# Altium project WTC_SPI_v2.PrjPcb
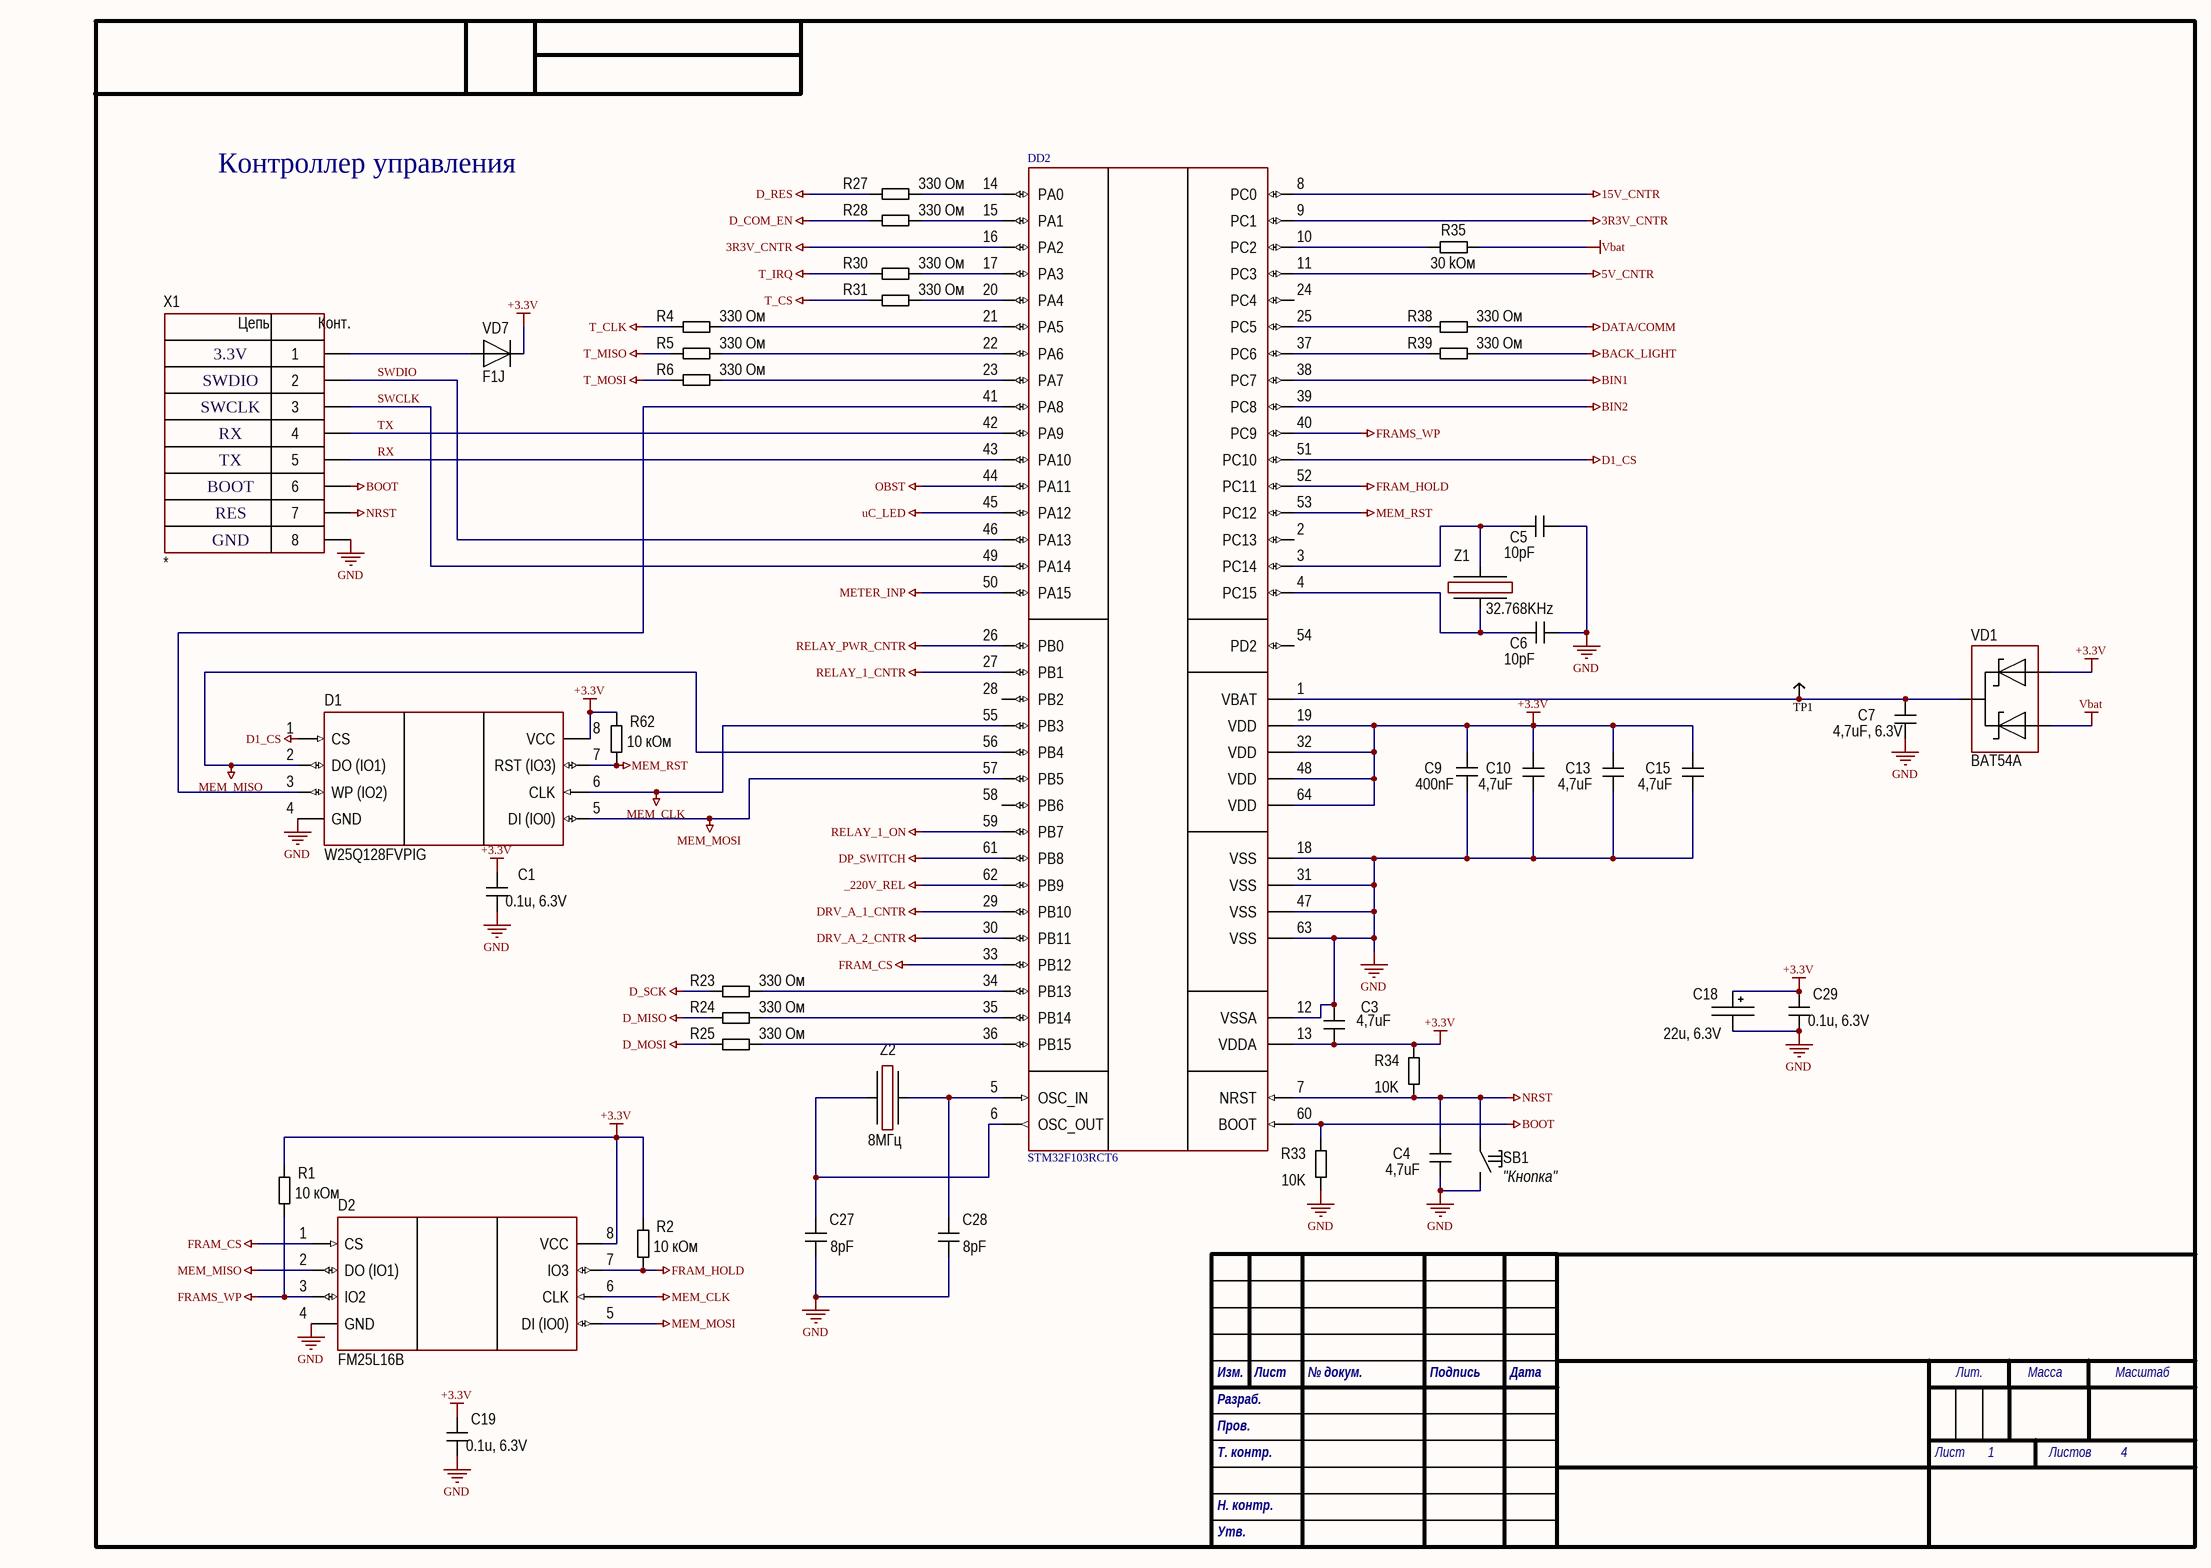
[diagram p0: 1_uC.SchDoc]
4 sheets, 159 parts. Net scope: global (net labels, ports and power ports of the same name join across sheets).
Board file: wtc_spi.PcbDoc
Sheets:
  1_uC.SchDoc
  2_PowerPerif.SchDoc
  3_InfoPerif.SchDoc
  4_PowerSupplie.SchDoc

## Sheet 1_uC.SchDoc
size 414 x 293 mm; SheetNumber: 1; SheetTotal: 4

### Parts
C1  0.1u, 6.3V  [CH0402C]
C3  4,7uF  [CH0402C]
C4  4,7uF  [CH0402C]
C5  10pF  [CH0402C]
C6  10pF  [CH0402C]
C7  4,7uF, 6.3V  [CH0402C]
C9  400nF  [CH0402C]
C10  4,7uF  [CH0402C]
C13  4,7uF  [CH0402C]
C15  4,7uF  [CH0402C]
C18  22u, 6.3V  [TANTAL_A]
C19  0.1u, 6.3V  [CH0402C]
C27  8pF  [CH0402C]
C28  8pF  [CH0402C]
C29  0.1u, 6.3V  [CH0402C]
D1  W25Q128FVPIG  [8-WSON (5x6mm)without_holes]
D2  FM25L16B  [8-SOIC]
DD2  STM32F103RCT6  [64-LQFP]
R1  10 кОм  [CH0402R]
R2  10 кОм  [CH0402R]
R4  330 Ом  [CH0402R]
R5  330 Ом  [CH0402R]
R6  330 Ом  [CH0402R]
R23  330 Ом  [CH0402R]
R24  330 Ом  [CH0402R]
R25  330 Ом  [CH0402R]
R27  330 Ом  [CH0402R]
R28  330 Ом  [CH0402R]
R30  330 Ом  [CH0402R]
R31  330 Ом  [CH0402R]
R33  10K  [CH0402R]
R34  10K  [CH0402R]
R35  30 kОм  [CH0402R]
R38  330 Ом  [CH0402R]
R39  330 Ом  [CH0402R]
R62  10 кОм  [CH0402R]
SB1  "Кнопка"  [TL1014BF160QG]
TP1  (no value)  [TestPoint]
VD1  BAT54A  [SOT23_123]
VD7  F1J  [SOD123F]
X1  *  [CON: PBS-8]
Z1  32.768KHz  [OSC: 3215]
Z2  8МГц  [OSC: ABM3]

### Nets
3R3V_CNTR: DD2.9(PC1) DD2.16(PA2)
5V_CNTR: DD2.11(PC3)
15V_CNTR: DD2.8(PC0)
+3.3V: C1.2 C3.1 C9.1 C10.2 C13.2 C15.2 C18.1 C19.2 C29.2 D1.8(VCC) D2.8(VCC) DD2.13(VDDA) DD2.19(VDD) DD2.32(VDD) DD2.48(VDD) DD2.64(VDD) R1.2 R2.2 R34.2 R62.2 VD1.1 VD7.2
_220V_REL: DD2.62(PB9)
BACK_LIGHT: R39.1
BIN1: DD2.38(PC7)
BIN2: DD2.39(PC8)
BOOT: DD2.60(BOOT) R33.2 X1.6
D1_CS: D1.1(CS) DD2.51(PC10)
D_COM_EN: R28.1
D_MISO: R24.1
D_MOSI: R25.1
D_RES: R27.1
D_SCK: R23.1
DATA/COMM: R38.1
DP_SWITCH: DD2.61(PB8)
DRV_A_1_CNTR: DD2.29(PB10)
DRV_A_2_CNTR: DD2.30(PB11)
FRAM_CS: D2.1(CS) DD2.33(PB12)
FRAM_HOLD: D2.7(IO3) DD2.52(PC11) R2.1
FRAMS_WP: D2.3(IO2) DD2.40(PC9) R1.1
GND: C1.1 C3.2 C4.1 C5.2 C6.1 C7.1 C9.2 C10.1 C13.1 C15.1 C18.2 C19.1 C27.1 C28.1 C29.1 D1.4(GND) D2.4(GND) DD2.12(VSSA) DD2.18(VSS) DD2.31(VSS) DD2.47(VSS) DD2.63(VSS) R33.1 SB1.2 X1.8
MEM_CLK: D1.6(CLK) D2.6(CLK) DD2.55(PB3)
MEM_MISO: D1.2(DO_(IO1)) D2.2(DO_(IO1)) DD2.56(PB4)
MEM_MOSI: D1.5(DI_(IO0)) D2.5(DI_(IO0)) DD2.57(PB5)
MEM_RST: D1.7(RST_(IO3)) DD2.53(PC12) R62.1
METER_INP: DD2.50(PA15)
NRST: C4.2 DD2.7(NRST) R34.1 SB1.1 X1.7
OBST: DD2.44(PA11)
RELAY_1_CNTR: DD2.27(PB1)
RELAY_1_ON: DD2.59(PB7)
RELAY_PWR_CNTR: DD2.26(PB0)
RX: DD2.43(PA10) X1.5
T_CLK: R4.1
T_CS: R31.1
T_IRQ: R30.1
T_MISO: R5.1
T_MOSI: R6.1
TX: DD2.42(PA9) X1.4
uC_LED: DD2.45(PA12)
Vbat: R35.1 VD1.3
SWCLK: DD2.49(PA14) X1.3
SWDIO: DD2.46(PA13) X1.2
NetC5_1: C5.1 DD2.3(PC14) Z1.3
NetC6_2: C6.2 DD2.4(PC15) Z1.1
NetC7_2: C7.2 DD2.1(VBAT) TP1.0 VD1.2
NetC27_2: C27.2 DD2.6(OSC_OUT) Z2.1
NetC28_2: C28.2 DD2.5(OSC_IN) Z2.3
NetD1_3: D1.3(WP_(IO2)) DD2.41(PA8)
NetDD2_10: DD2.10(PC2) R35.2
NetDD2_14: DD2.14(PA0) R27.2
NetDD2_15: DD2.15(PA1) R28.2
NetDD2_17: DD2.17(PA3) R30.2
NetDD2_20: DD2.20(PA4) R31.2
NetDD2_21: DD2.21(PA5) R4.2
NetDD2_22: DD2.22(PA6) R5.2
NetDD2_23: DD2.23(PA7) R6.2
NetDD2_25: DD2.25(PC5) R38.2
NetDD2_34: DD2.34(PB13) R23.2
NetDD2_35: DD2.35(PB14) R24.2
NetDD2_36: DD2.36(PB15) R25.2
NetDD2_37: DD2.37(PC6) R39.2
NetVD7_1: VD7.1 X1.1

Not connected (* = marked no-connect by the designer): DD2 2(PC13) 24(PC4) 28(PB2) 54(PD2) 58(PB6)

### Notes on the sheet
- Контроллер управления
- 3.3V
- SWDIO
- SWCLK
- RX
- TX
- BOOT
- RES
- GND
- Изм.
- Лист
- № докум.
- Подпись
- Дата
- Лит.
- Масса
- Масштаб
- Пров.
- Разраб.
- Т. контр.
- Н. контр.
- Листов
- Утв.
- (in symbol 8-Connector) Цепь; Конт.

### Library data of the parts
C1 C7 C19 C29 = Capacitor: Manufacturer: *; Model: *; HelpURL: *; ComponentKind: *; Value: *
C3-C6 C9 C10 C13 C15 C27 C28 = Capacitor: 0402; Manufacturer: *; Model: *; HelpURL: *; ComponentKind: *; Value: *
C18 = TantalCap: Manufacturer: *; Model: *; HelpURL: *; ComponentKind: *; Value: *
D1 = W25Q128FVPIG: Flash; Manufacturer: Winbond Electronics; Model: W25Q128FVPIG; HelpURL: https://www.digikey.com/product-detail/en/winbond-electronics/W25Q128FVPIG/W25Q128FVPIG-ND/4037386; ComponentKind: 8-WSON
D2 = W25Q80JVSSIQ: Flash; Manufacturer: Winbond Electronics; Model: W25Q80JVSSIQ; HelpURL: https://www.digikey.com/product-detail/en/winbond-electronics/W25Q80JVSSIQ/W25Q80JVSSIQ-ND/6193772; ComponentKind: 8-SOIC
DD2 = STM32F103RCT6: Cortex-M3 (64-LQFP)
R1 R2 R4-R6 R23-R25 R27 R28 R30 R31 R35 R38 R39 R62 = Resistor: 0603; Manufacturer: *; Model: *; HelpURL: *; ComponentKind: *; Value: *
R33 R34 = Resistor: 0805; Manufacturer: *; Model: *; HelpURL: *; ComponentKind: *; Value: *
SB1 = Tactile switches: 6x6 mm; Manufacturer: *; Model: *; HelpURL: *; ComponentKind: *
TP1 = TestPoint
VD1 = Diod Schottky Array v.1: SOT-23; ComponentKind: *; Manufacturer: *; Model: *; HelpURL: *
VD7 = Diod: ComponentKind: *; Manufacturer: *; Model: *; HelpURL: *
X1 = 8-Connector: Pin header 8; Model: *; Manufacturer: *; HelpURL: *; ComponentKind: *
Z1 = Oscillator: Manufacturer: *; Model: *; HelpURL: *; ComponentKind: *; Value: *
Z2 = Oscillator: NX5032GA-8MHz; Manufacturer: *; Model: *; HelpURL: *; ComponentKind: *; Value: *

## Sheet 2_PowerPerif.SchDoc
size 414 x 293 mm; SheetNumber: 2; SheetTotal: 4
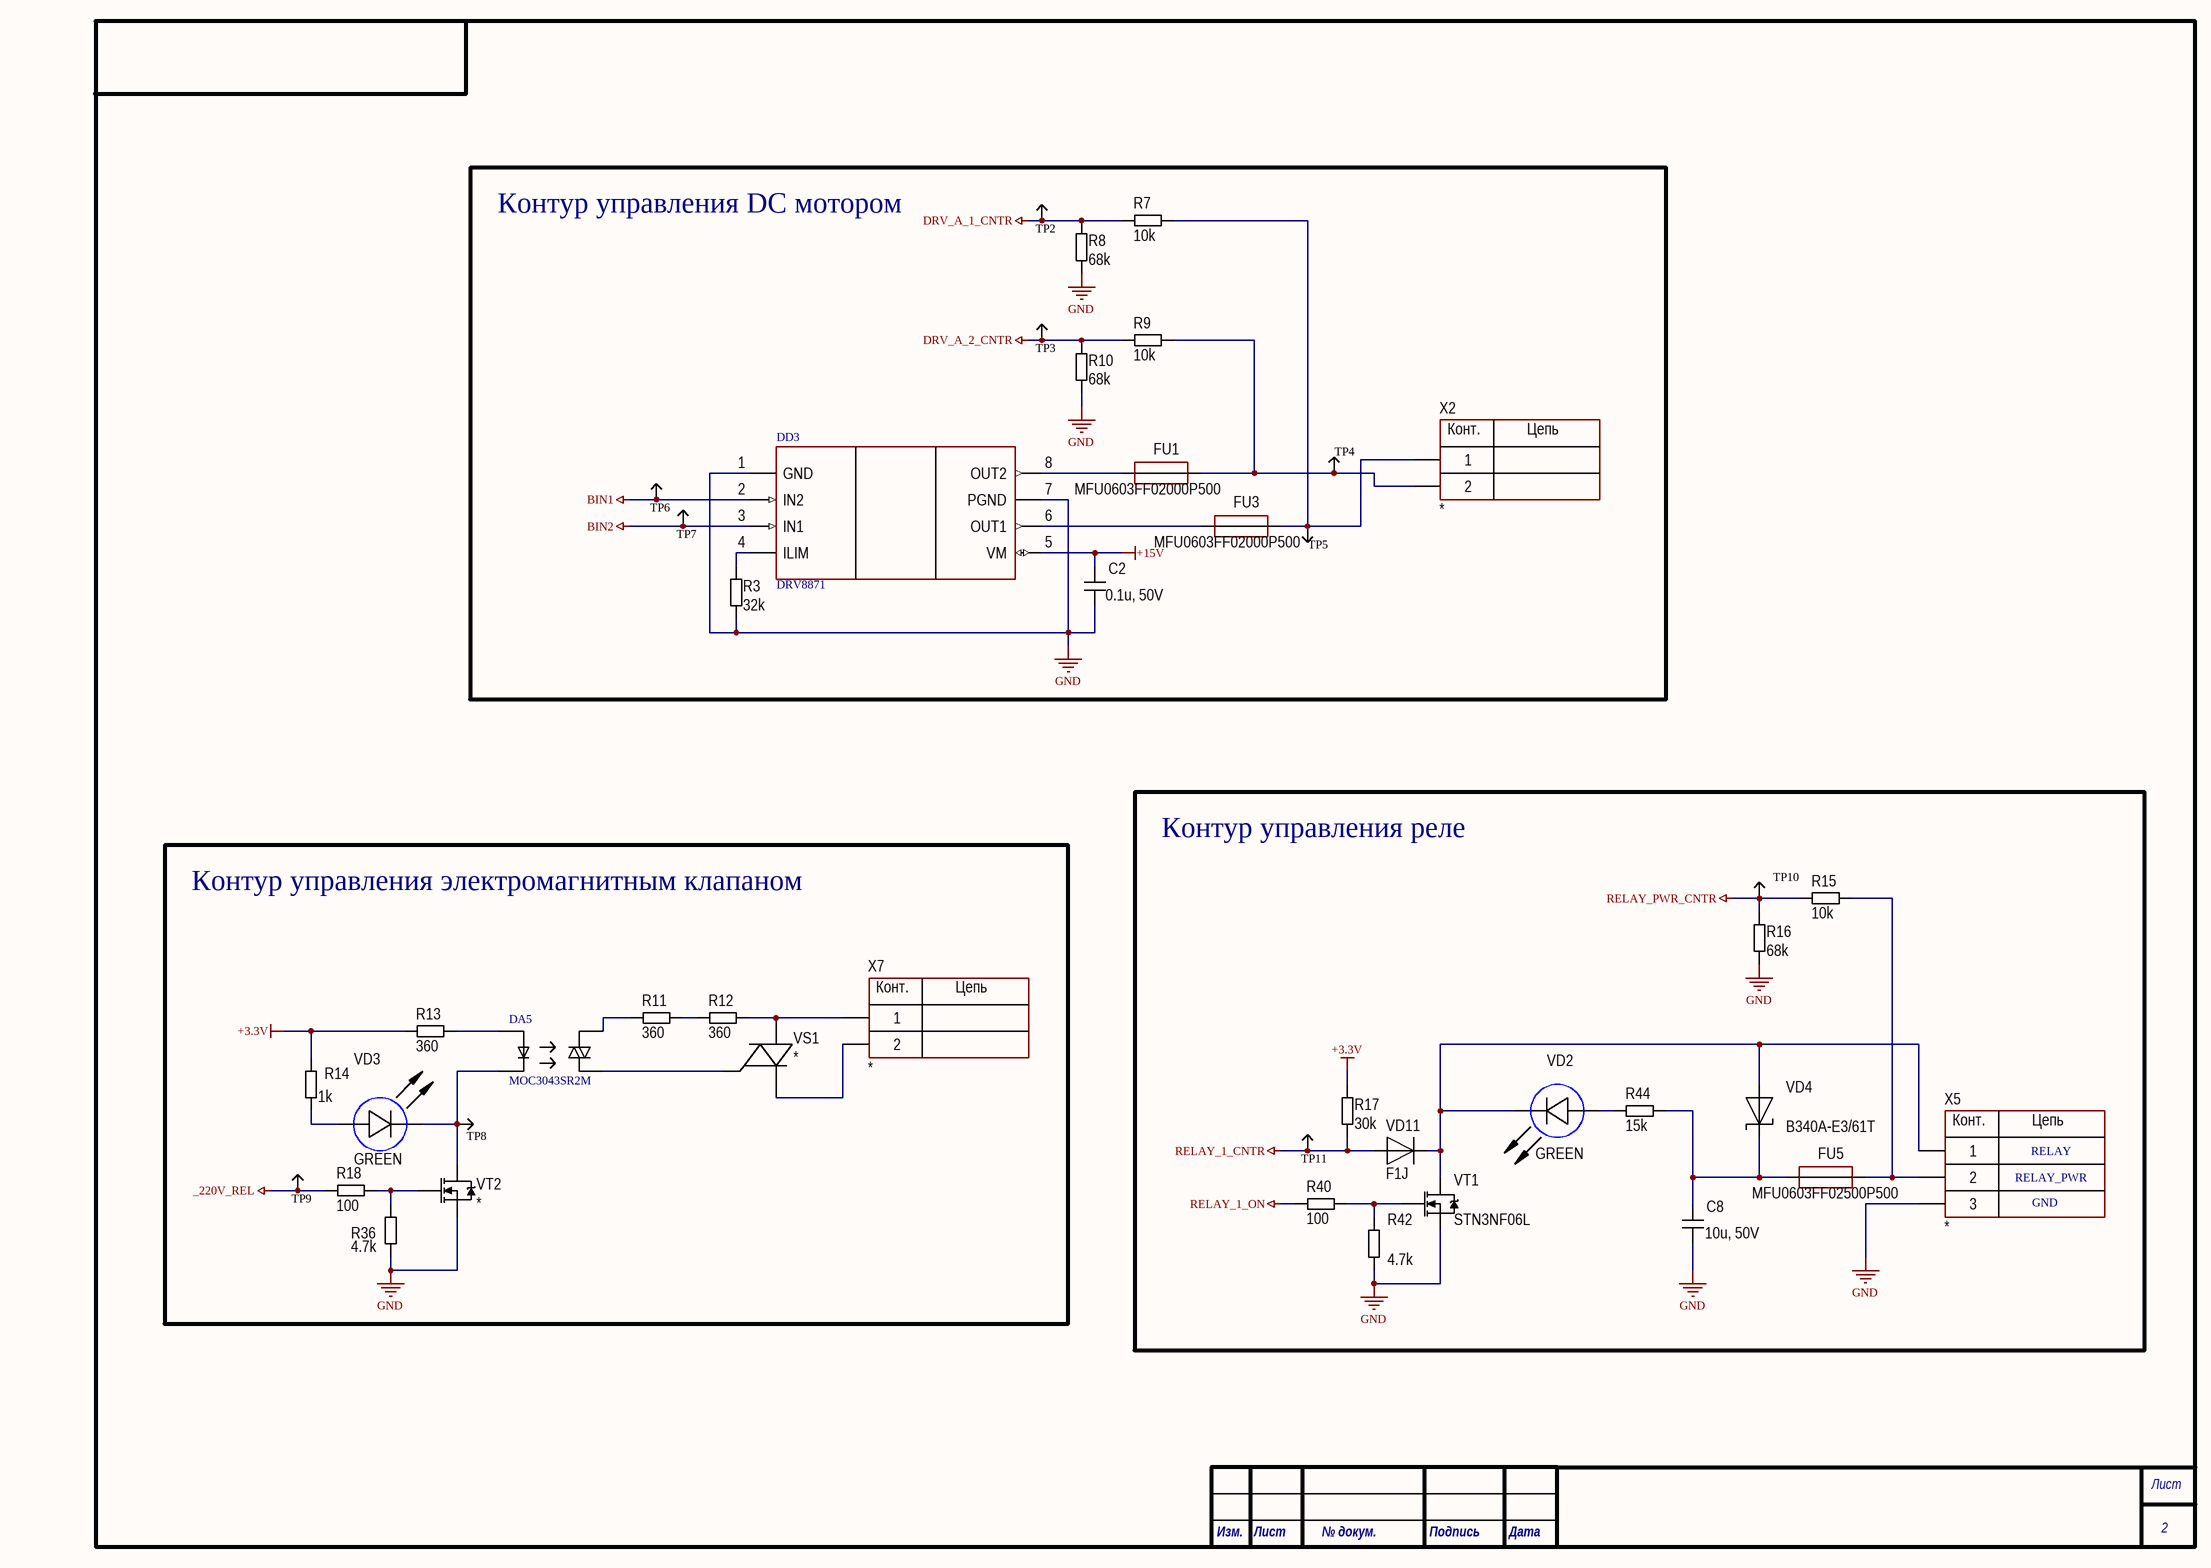
[diagram p1: 2_PowerPerif.SchDoc]

### Parts
C2  0.1u, 50V  [CH0402C]
C8  10u, 50V  [CH1206C]
DA5  MOC3043SR2M  [DIP6]
DD3  DRV8871  [8-HSOP]
FU1  MFU0603FF02000P500  [CH0603F]
FU3  MFU0603FF02000P500  [CH0603F]
FU5  MFU0603FF02500P500  [CH0603F]
R3  32k  [CH0603R]
R7  10k  [CH0402R]
R8  68k  [CH0402R]
R9  10k  [CH0402R]
R10  68k  [CH0402R]
R11  360  [CH1206R]
R12  360  [CH1206R]
R13  360  [CH0805R]
R14  1k  [CH0805R]
R15  10k  [CH0402R]
R16  68k  [CH0402R]
R17  30k  [CH0402R]
R18  100  [CH0805R]
R36  4.7k  [CH0402R]
R40  100  [CH0805R]
R42  4.7k  [CH0402R]
R44  15k  [CH0805R]
TP2  (no value)  [TestPoint]
TP3  (no value)  [TestPoint]
TP4  (no value)  [TestPoint]
TP5  (no value)  [TestPoint]
TP6  (no value)  [TestPoint]
TP7  (no value)  [TestPoint]
TP8  (no value)  [TestPoint]
TP9  (no value)  [TestPoint]
TP10  (no value)  [TestPoint]
TP11  (no value)  [TestPoint]
VD2  GREEN  [CH0603LB]
VD3  GREEN  [CH0603LB]
VD4  B340A-E3/61T  [SMA]
VD11  F1J  [SOD123F]
VS1  *  [SOT223_G-D-S]
VT1  STN3NF06L  [SOT223_G-D-S]
VT2  *  [SOT23_123]
X2  *  [CON: MX-22-05-3021]
X5  *  [CON: 300-03P-5.0]
X7  *  [CON: 300-02P-5.0]

### Blocks framed on the sheet
Контур управления DC мотором: C2 DD3 FU1 FU3 R3 R7-R10 TP2-TP7 X2
Контур управления реле: C8 FU5 R15-R17 R40 R42 R44 TP10 TP11 VD2 VD4 VD11 VT1 X5
Контур управления электромагнитным клапаном: DA5 R11-R14 R18 R36 TP8 TP9 VD3 VS1 VT2 X7

### Nets
+3.3V: R13.2 R14.2 R17.2
+15V: C2.2 DD3.5(VM)
_220V_REL: R18.2 TP9.0
BIN1: DD3.2(IN2) TP6.0
BIN2: DD3.3(IN1) TP7.0
DRV_A_1_CNTR: R7.1 R8.2 TP2.0
DRV_A_2_CNTR: R9.1 R10.2 TP3.0
GND: C2.1 C8.1 DD3.1(GND) DD3.7(PGND) R3.1 R8.1 R10.1 R16.1 R36.1 R42.1 VT1.3(S) VT2.3(S) X5.3
RELAY_1_CNTR: R17.1 TP11.0 VD11.1
RELAY_1_ON: R40.2
RELAY_PWR_CNTR: R15.1 R16.2 TP10.0
NetC8_2: C8.2 FU5.1 R44.2 VD4.2
NetDA5_1: DA5.1(Vpr+) R13.1
NetDA5_2: DA5.2(Vpr-) TP8.0 VD3.2(C) VT2.2(D)
NetDA5_4: DA5.4 R11.2
NetDA5_6: DA5.6 VS1.3
NetDD3_4: DD3.4(ILIM) R3.2
NetDD3_6: DD3.6(OUT1) FU3.1
NetDD3_8: DD3.8(OUT2) FU1.1
NetFU1_2: FU1.2 R9.2 TP4.0 X2.2
NetFU3_2: FU3.2 R7.2 TP5.0 X2.1
NetFU5_2: FU5.2 R15.2 X5.2
NetR11_1: R11.1 R12.2
NetR12_1: R12.1 VS1.2 X7.1
NetR14_1: R14.1 VD3.1(A)
NetR18_1: R18.1 R36.2 VT2.1(G)
NetR40_1: R40.1 R42.2 VT1.1(G)
NetR44_1: R44.1 VD2.1(A)
NetVD2_2: VD2.2(C) VD4.1 VD11.2 VT1.2(D) X5.1
NetVS1_1: VS1.1 X7.2

### Notes on the sheet
- RELAY
- RELAY_PWR
- GND
- Лист
- Изм.
- № докум.
- Подпись
- Дата
- (in symbol 2-Connector) Конт.; Цепь
- (in symbol 3-Connector) Конт.; Цепь

### Library data of the parts
C2 C8 = Capacitor: Manufacturer: *; Model: *; HelpURL: *; ComponentKind: *; Value: *
DA5 = MOC3063
FU1 FU3 FU5 = Fuse: Manufacturer: *; Model: *; HelpURL: *; ComponentKind: *; Value: *
R3 R7-R18 R36 R40 R42 R44 = Resistor: Manufacturer: *; Model: *; HelpURL: *; ComponentKind: *; Value: *
TP2-TP11 = TestPoint
VD2 VD3 = LED_1: Manufacturer: *; Model: *; HelpURL: *; ComponentKind: *; Value: *
VD4 = Diod Schottky: ComponentKind: *; Manufacturer: *; Model: *; HelpURL: *
VD11 = Diod: ComponentKind: *; Manufacturer: *; Model: *; HelpURL: *
VS1 = TRIAC: Bipolar; Model: *; Manufacturer: *; ComponentKind: *; HelpURL: *
VT1 VT2 = N-chanel: Mosfet; Manufacturer: *; ComponentKind: *; HelpURL: *
  VT1: Model: STN3NF06L
  VT2: Model: *
X2 X7 = 2-Connector: Model: *; Manufacturer: *; HelpURL: *; ComponentKind: *
X5 = 3-Connector: Model: *; Manufacturer: *; HelpURL: *; ComponentKind: *

## Sheet 3_InfoPerif.SchDoc
size 414 x 293 mm; SheetNumber: 3; SheetTotal: 4
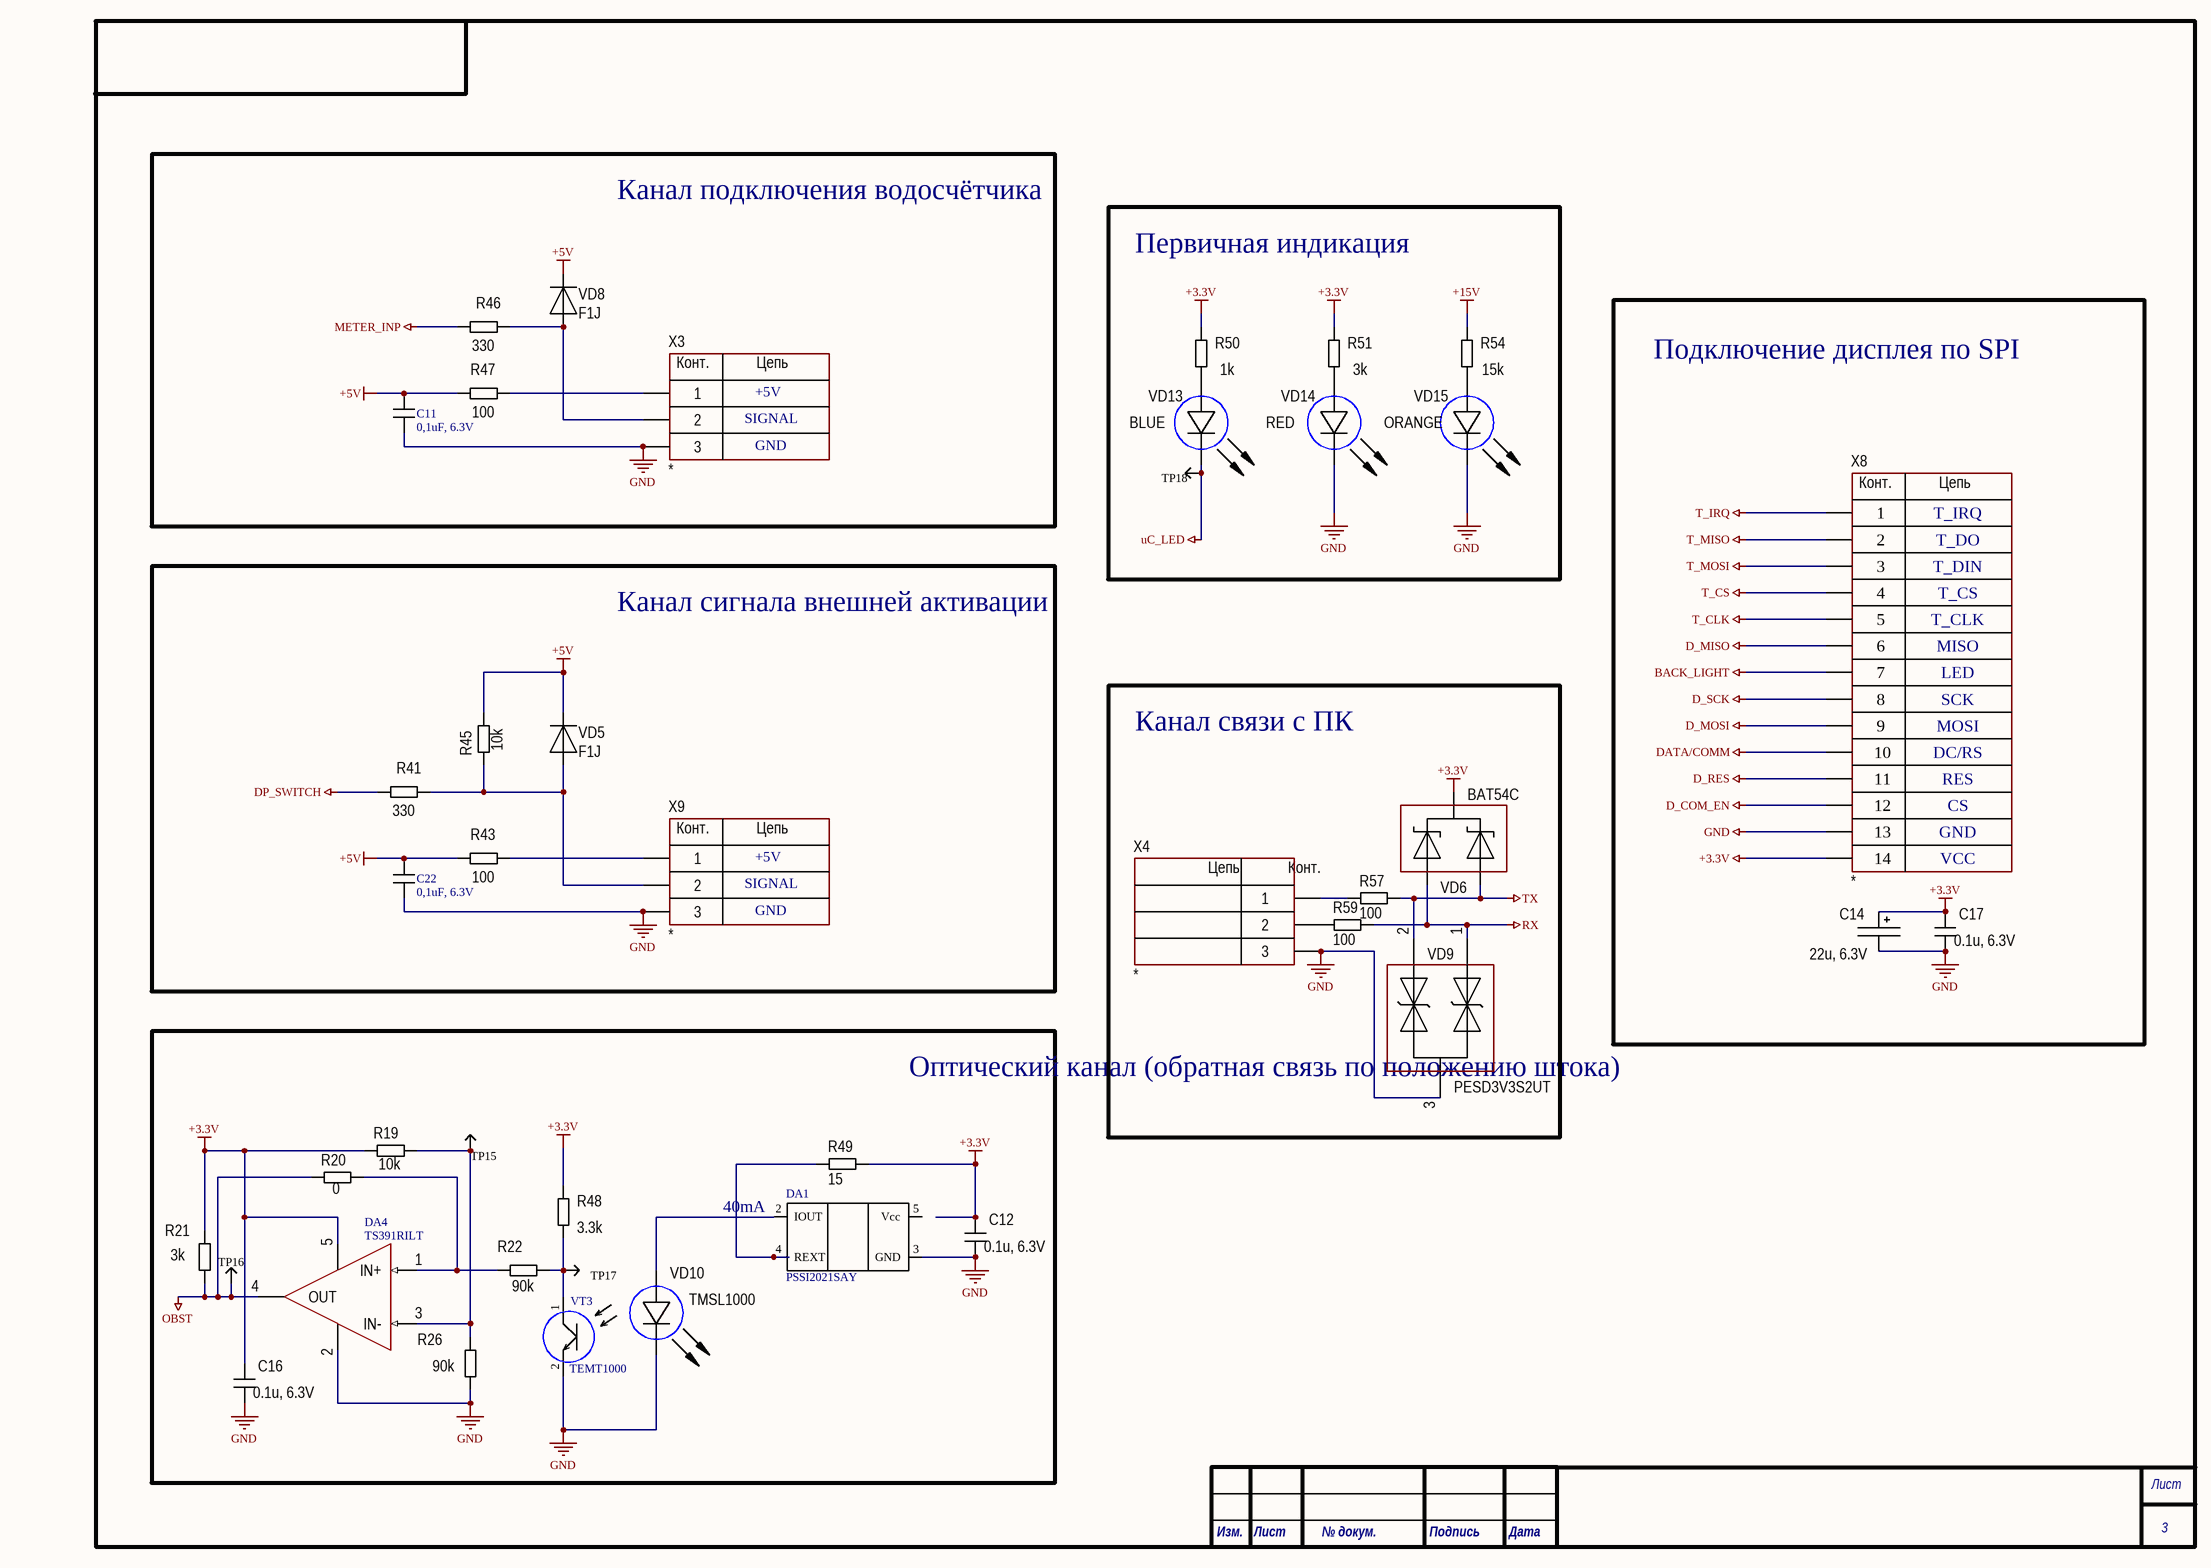
[diagram p2: 3_InfoPerif.SchDoc]

### Parts
C11  0,1uF, 6.3V  [C_0603]
C12  0.1u, 6.3V  [CH0402C]
C14  22u, 6.3V  [TANTAL_A]
C16  0.1u, 6.3V  [CH0402C]
C17  0.1u, 6.3V  [CH0402C]
C22  0,1uF, 6.3V  [C_0603]
DA1  PSSI2021SAY  [SOT353]
DA4  TS391RILT  [SOT23-5]
R19  10k  [CH0402R]
R20  0  [CH0402R]
R21  3k  [CH0402R]
R22  90k  [CH0402R]
R26  90k  [CH0402R]
R41  330  [CH0402R]
R43  100  [CH0805R]
R45  10k  [CH0603R]
R46  330  [CH0402R]
R47  100  [CH0805R]
R48  3.3k  [CH0402R]
R49  15  [CH0805R]
R50  1k  [CH0805R]
R51  3k  [CH0805R]
R54  15k  [CH0805R]
R57  100  [CH0402R]
R59  100  [CH0402R]
TP15  (no value)  [TestPoint]
TP16  (no value)  [TestPoint]
TP17  (no value)  [TestPoint]
TP18  (no value)  [TestPoint]
VD5  F1J  [SOD123F]
VD6  BAT54C  [SOT23_123]
VD8  F1J  [SOD123F]
VD9  PESD3V3S2UT  [SOT23_132]
VD10  TMSL1000  [TSML1000]
VD13  BLUE  [CH0603LB]
VD14  RED  [CH0603LB]
VD15  ORANGE  [CH0603LB]
VT3  TEMT1000  [TEMT1000]
X3  *  [CON: MX-22-05-3031]
X4  *  [CON: MX-22-05-3031]
X8  *  [DS1024-14]
X9  *  [CON: MX-22-05-3031]

### Blocks framed on the sheet
Канал подключения водосчётчика: C11 R46 R47 VD8 X3
Первичная индикация: R50 R51 R54 TP18 VD13-VD15
Подключение дисплея по SPI: C14 C17 X8
Канал сигнала внешней активации: C22 R41 R43 R45 VD5 X9
Канал связи с ПК: R57 R59 VD6 VD9 X4
Оптический канал (обратная связь по положению штока): C12 C16 DA1 DA4 R19-R22 R26 R48 R49 TP15-TP17 VD10 VT3

### Nets
+3.3V: C12.2 C14.1 C16.2 C17.2 DA4.5(V+) R19.2 R21.2 R48.2 R49.2 R50.2 R51.2 VD6.2 X8.14
+5V: C11.2 C22.2 R43.1 R45.1 R47.1 VD5.2 VD8.2
+15V: R54.2
BACK_LIGHT: X8.7
D_COM_EN: X8.12
D_MISO: X8.6
D_MOSI: X8.9
D_RES: X8.11
D_SCK: X8.8
DATA/COMM: X8.10
DP_SWITCH: R41.1
GND: C11.1 C12.1 C14.2 C16.1 C17.1 C22.1 DA1.3(GND) DA4.2(V-) R26.1 VD9.3 VD10.2(C) VD14.2(C) VD15.2(C) VT3.2 X3.3 X4.3 X8.13 X9.3
METER_INP: R46.1
OBST: DA4.4(OUT) R20.2 R21.1 TP16.0
RX: R59.2 VD6.3 VD9.1
T_CLK: X8.5
T_CS: X8.4
T_IRQ: X8.1
T_MISO: X8.2
T_MOSI: X8.3
TX: R57.2 VD6.1 VD9.2
uC_LED: TP18.0 VD13.2(C)
NetDA1_2: DA1.2(IOUT) VD10.1(A)
NetDA1_4: DA1.4(REXT) R49.1
NetDA4_1: DA4.1(IN+) R20.1 R22.2
NetDA4_3: DA4.3(IN-) R19.1 R26.2 TP15.0
NetR22_1: R22.1 R48.1 TP17.0 VT3.1
NetR41_2: R41.2 R45.2 VD5.1 X9.2
NetR43_2: R43.2 X9.1
NetR46_2: R46.2 VD8.1 X3.2
NetR47_2: R47.2 X3.1
NetR50_1: R50.1 VD13.1(A)
NetR51_1: R51.1 VD14.1(A)
NetR54_1: R54.1 VD15.1(A)
NetR57_1: R57.1 X4.1
NetR59_1: R59.1 X4.2

Not connected (* = marked no-connect by the designer): DA1 5(Vcc)

### Notes on the sheet
- SIGNAL
- +5V
- GND
- T_IRQ
- T_DO
- T_DIN
- T_CS
- T_CLK
- MISO
- LED
- SCK
- MOSI
- DC/RS
- RES
- CS
- VCC
- 40mA
- Лист
- Изм.
- № докум.
- Подпись
- Дата
- (in symbol 14-Connector) Конт.; Цепь
- (in symbol 4-Connector) Конт.; Цепь

### Library data of the parts
C11 C22 = C_SMD
C12 C16 = Capacitor: 0805; Manufacturer: *; Model: *; HelpURL: *; ComponentKind: *; Value: *
C14 = TantalCap: Manufacturer: *; Model: *; HelpURL: *; ComponentKind: *; Value: *
C17 = Capacitor: Manufacturer: *; Model: *; HelpURL: *; ComponentKind: *; Value: *
DA1 = PSSI2021SAY: Iout = 0.617/Rext + 15 µA
DA4 = LMV331M5: SOT23-5
R19-R22 R26 R41 R43 R45-R47 R50 R51 R54 R57 R59 = Resistor: Manufacturer: *; Model: *; HelpURL: *; ComponentKind: *; Value: *
R48 R49 = Resistor: 0805; Manufacturer: *; Model: *; HelpURL: *; ComponentKind: *; Value: *
TP15-TP18 = TestPoint
VD5 VD8 = Diod: ComponentKind: *; Manufacturer: *; Model: *; HelpURL: *
VD6 = Diod Schottky Array v.1: ComponentKind: *; Manufacturer: *; Model: *; HelpURL: *
VD9 = TVS Array: ComponentKind: *; Manufacturer: *; Model: *; HelpURL: *
VD10 VD13-VD15 = LED_1: Manufacturer: *; Model: *; HelpURL: *; ComponentKind: *; Value: *
X3 X4 X9 = 3-Connector: Model: *; Manufacturer: *; HelpURL: *; ComponentKind: *
X8 = 14-Connector: Model: *; Manufacturer: *; HelpURL: *; ComponentKind: *

## Sheet 4_PowerSupplie.SchDoc
size 414 x 293 mm; SheetNumber: 4; SheetTotal: 4; PageSetup: Record=PageOptionsZCenterHorizontal=TrueZCenterVertical=TrueZPrintScale=1.00ZXCorrection=0.00ZYCorrection=0.00ZPrintKind=1ZBorderSize=5000000ZLeftOffset=0ZBottomOffset=0ZOrientation=2ZPaperLength=1000ZPaperWidth=1000ZScale=100ZPaperSource=7ZPrintQuality=-4ZMediaType=1ZDitherType=10ZPaperKind=A3ZPrintScaleMode=0; Razrabotal: {Разработал}; Proveril: {Проверил}; Tkontr: {Т.контр.}; Nkontr: {Н.контр.}; Ytverdil: {Утвердил}; Nazvanie1: {Название1}; Nazvanie2: {Название2}; Oboznachenie: {Обозначение}
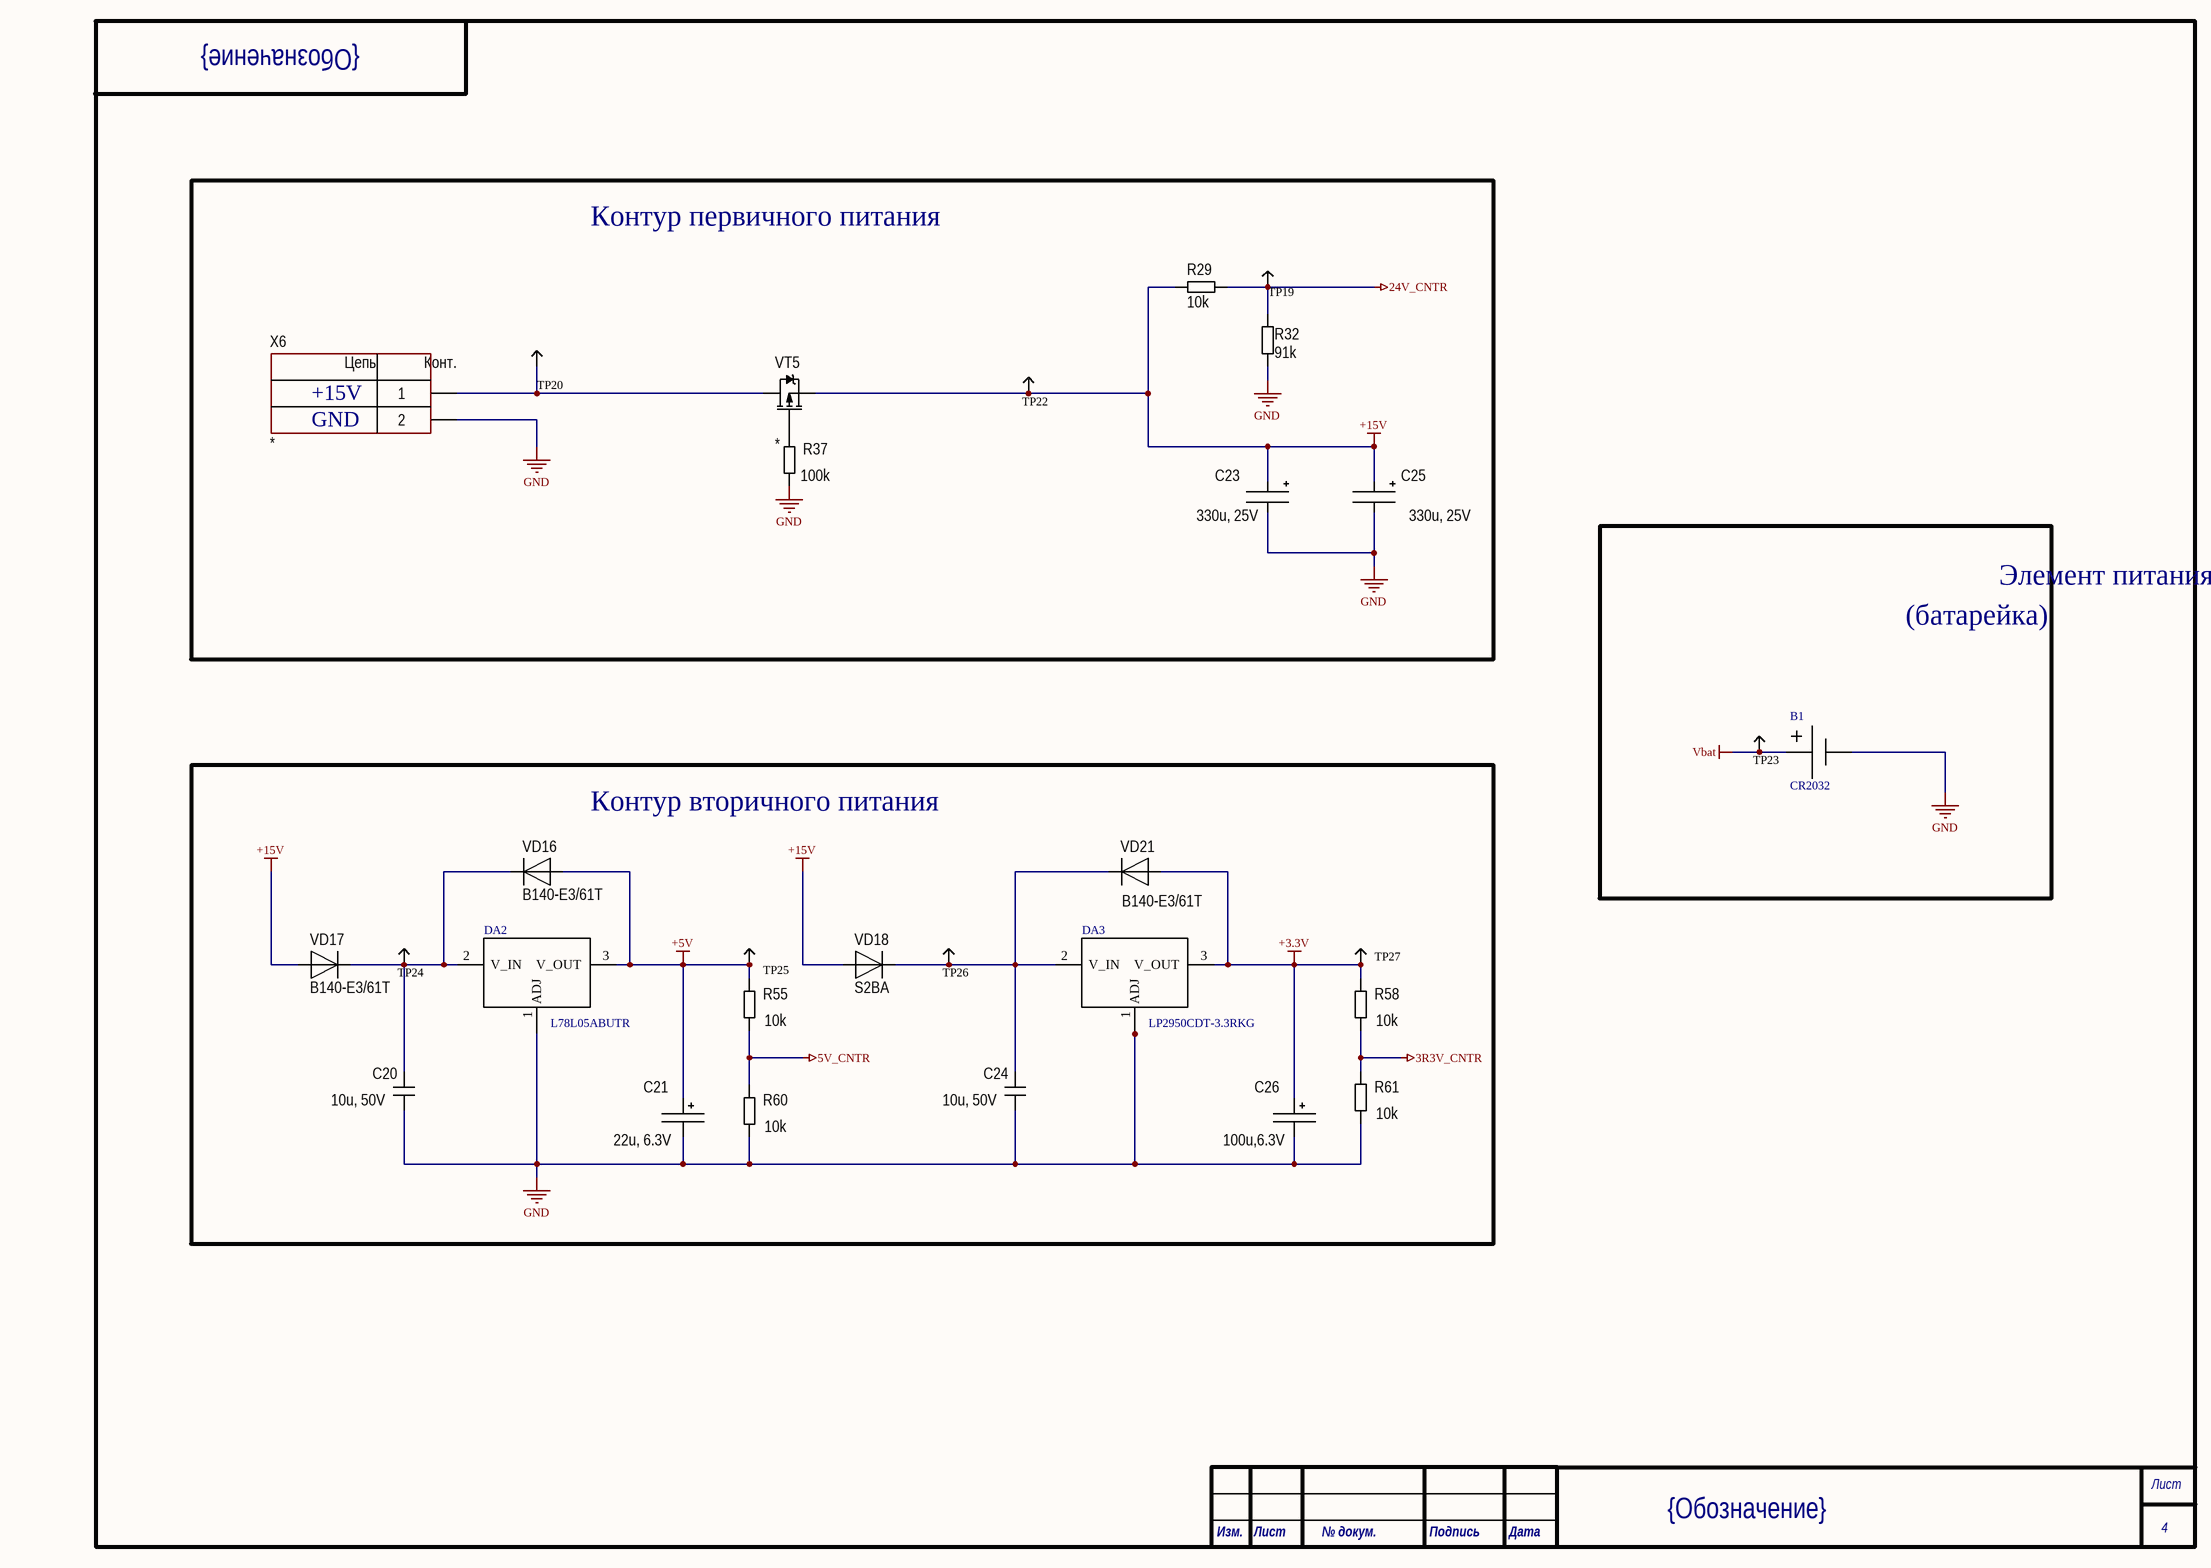
[diagram p3: 4_PowerSupplie.SchDoc]

### Parts
B1  CR2032  [BAT: CR2032_SM]
C20  10u, 50V  [CH1206C]
C21  22u, 6.3V  [TANTAL_A]
C23  330u, 25V  [D10C4.4H10]
C24  10u, 50V  [CH1206C]
C25  330u, 25V  [D10C4.4H10]
C26  100u,6.3V  [TANTAL_B]
DA2  L78L05ABUTR  [SOT89_PC12120]
DA3  LP2950CDT-3.3RKG  [DPAK_213]
R29  10k  [CH0402R]
R32  91k  [CH0402R]
R37  100k  [CH0402R]
R55  10k  [CH0402R]
R58  10k  [CH0402R]
R60  10k  [CH0402R]
R61  10k  [CH0402R]
TP19  (no value)  [TestPoint]
TP20  (no value)  [TestPoint]
TP22  (no value)  [TestPoint]
TP23  (no value)  [TestPoint]
TP24  (no value)  [TestPoint]
TP25  (no value)  [TestPoint]
TP26  (no value)  [TestPoint]
TP27  (no value)  [TestPoint]
VD16  B140-E3/61T  [SMA]
VD17  B140-E3/61T  [SMA]
VD18  S2BA  [SMA]
VD21  B140-E3/61T  [SMA]
VT5  *  [PQFN-3x3]
X6  *  [CON: MX-22-05-3021]

### Blocks framed on the sheet
Контур первичного питания: C23 C25 R29 R32 R37 TP19 TP20 TP22 VT5 X6
Контур вторичного питания: C20 C21 C24 C26 DA2 DA3 R55 R58 R60 R61 TP24-TP27 VD16-VD18 VD21

### Nets
3R3V_CNTR: R58.1 R61.2
5V_CNTR: R55.1 R60.2
24V_CNTR: R29.1 R32.2 TP19.0
+3.3V: C26.1 DA3.3(V_OUT) R58.2 TP27.0 VD21.1
+5V: C21.1 DA2.3(V_OUT) R55.2 TP25.0 VD16.1
+15V: C23.1 C25.1 R29.2 TP22.0 VD17.1 VD18.1 VT5.3(S)
GND: B1.2 C20.1 C21.2 C23.2 C24.1 C25.2 C26.2 DA2.1(ADJ) DA3.1(ADJ) R32.1 R37.1 R60.1 R61.1 X6.2
Vbat: B1.1 TP23.0
NetC20_2: C20.2 DA2.2(V_IN) TP24.0 VD16.2 VD17.2
NetC24_2: C24.2 DA3.2(V_IN) TP26.0 VD18.2 VD21.2
NetR37_2: R37.2 VT5.1(G)
NetTP20_0: TP20.0 VT5.2(D) X6.1

### Notes on the sheet
- +15V
- GND
- (батарейка)
- Элемент питания CR2032
- Лист
- Изм.
- № докум.
- Подпись
- Дата
- (in symbol 2-Connector) Цепь; Конт.

### Library data of the parts
B1 = Battery_CR2032
C20 C24 = Capacitor: Manufacturer: *; Model: *; HelpURL: *; ComponentKind: *; Value: *
C21 C26 = TantalCap: Manufacturer: *; Model: *; HelpURL: *; ComponentKind: *; Value: *
C23 C25 = AlumCap: Manufacturer: *; Model: *; HelpURL: *; ComponentKind: *; Value: *
DA2 DA3 = LM1117
R29 R32 R37 R55 R58 R60 R61 = Resistor: Manufacturer: *; Model: *; HelpURL: *; ComponentKind: *; Value: *
TP19 TP20 TP22-TP27 = TestPoint
VD16-VD18 VD21 = Diod: ComponentKind: *; Manufacturer: *; Model: *; HelpURL: *
VT5 = P-chanel: Mosfet; Model: *; Manufacturer: *; ComponentKind: *; HelpURL: *
X6 = 2-Connector: Model: *; Manufacturer: *; HelpURL: *; ComponentKind: *

## Nets that join several sheets
3R3V_CNTR: 1_uC (DD2.9 DD2.16), 4_PowerSupplie (R58.1 R61.2)
5V_CNTR: 1_uC (DD2.11), 4_PowerSupplie (R55.1 R60.2)
+3.3V: 1_uC (22 pins), 2_PowerPerif (R13.2 R14.2 R17.2), 3_InfoPerif (13 pins), 4_PowerSupplie (5 pins)
+5V: 3_InfoPerif (7 pins), 4_PowerSupplie (5 pins)
+15V: 2_PowerPerif (C2.2 DD3.5), 3_InfoPerif (R54.2), 4_PowerSupplie (7 pins)
_220V_REL: 1_uC (DD2.62), 2_PowerPerif (R18.2 TP9.0)
BACK_LIGHT: 1_uC (R39.1), 3_InfoPerif (X8.7)
BIN1: 1_uC (DD2.38), 2_PowerPerif (DD3.2 TP6.0)
BIN2: 1_uC (DD2.39), 2_PowerPerif (DD3.3 TP7.0)
D_COM_EN: 1_uC (R28.1), 3_InfoPerif (X8.12)
D_MISO: 1_uC (R24.1), 3_InfoPerif (X8.6)
D_MOSI: 1_uC (R25.1), 3_InfoPerif (X8.9)
D_RES: 1_uC (R27.1), 3_InfoPerif (X8.11)
D_SCK: 1_uC (R23.1), 3_InfoPerif (X8.8)
DATA/COMM: 1_uC (R38.1), 3_InfoPerif (X8.10)
DP_SWITCH: 1_uC (DD2.61), 3_InfoPerif (R41.1)
DRV_A_1_CNTR: 1_uC (DD2.29), 2_PowerPerif (R7.1 R8.2 TP2.0)
DRV_A_2_CNTR: 1_uC (DD2.30), 2_PowerPerif (R9.1 R10.2 TP3.0)
GND: 1_uC (25 pins), 2_PowerPerif (13 pins), 3_InfoPerif (18 pins), 4_PowerSupplie (14 pins)
METER_INP: 1_uC (DD2.50), 3_InfoPerif (R46.1)
OBST: 1_uC (DD2.44), 3_InfoPerif (DA4.4 R20.2 R21.1 TP16.0)
RELAY_1_CNTR: 1_uC (DD2.27), 2_PowerPerif (R17.1 TP11.0 VD11.1)
RELAY_1_ON: 1_uC (DD2.59), 2_PowerPerif (R40.2)
RELAY_PWR_CNTR: 1_uC (DD2.26), 2_PowerPerif (R15.1 R16.2 TP10.0)
RX: 1_uC (DD2.43 X1.5), 3_InfoPerif (R59.2 VD6.3 VD9.1)
T_CLK: 1_uC (R4.1), 3_InfoPerif (X8.5)
T_CS: 1_uC (R31.1), 3_InfoPerif (X8.4)
T_IRQ: 1_uC (R30.1), 3_InfoPerif (X8.1)
T_MISO: 1_uC (R5.1), 3_InfoPerif (X8.2)
T_MOSI: 1_uC (R6.1), 3_InfoPerif (X8.3)
TX: 1_uC (DD2.42 X1.4), 3_InfoPerif (R57.2 VD6.1 VD9.2)
uC_LED: 1_uC (DD2.45), 3_InfoPerif (TP18.0 VD13.2)
Vbat: 1_uC (R35.1 VD1.3), 4_PowerSupplie (B1.1 TP23.0)